# EasyEDA Pro project 04_InterfacePart.epro

# Schematic Schematic4
Create Date: 2024-08-07; Page Name: P1; Project Name: 264母板; Schematic Name: Schematic4; Update Date: 2024-08-07; Company: 嘉立创EDA; Page Size: A3; Version: V1.0
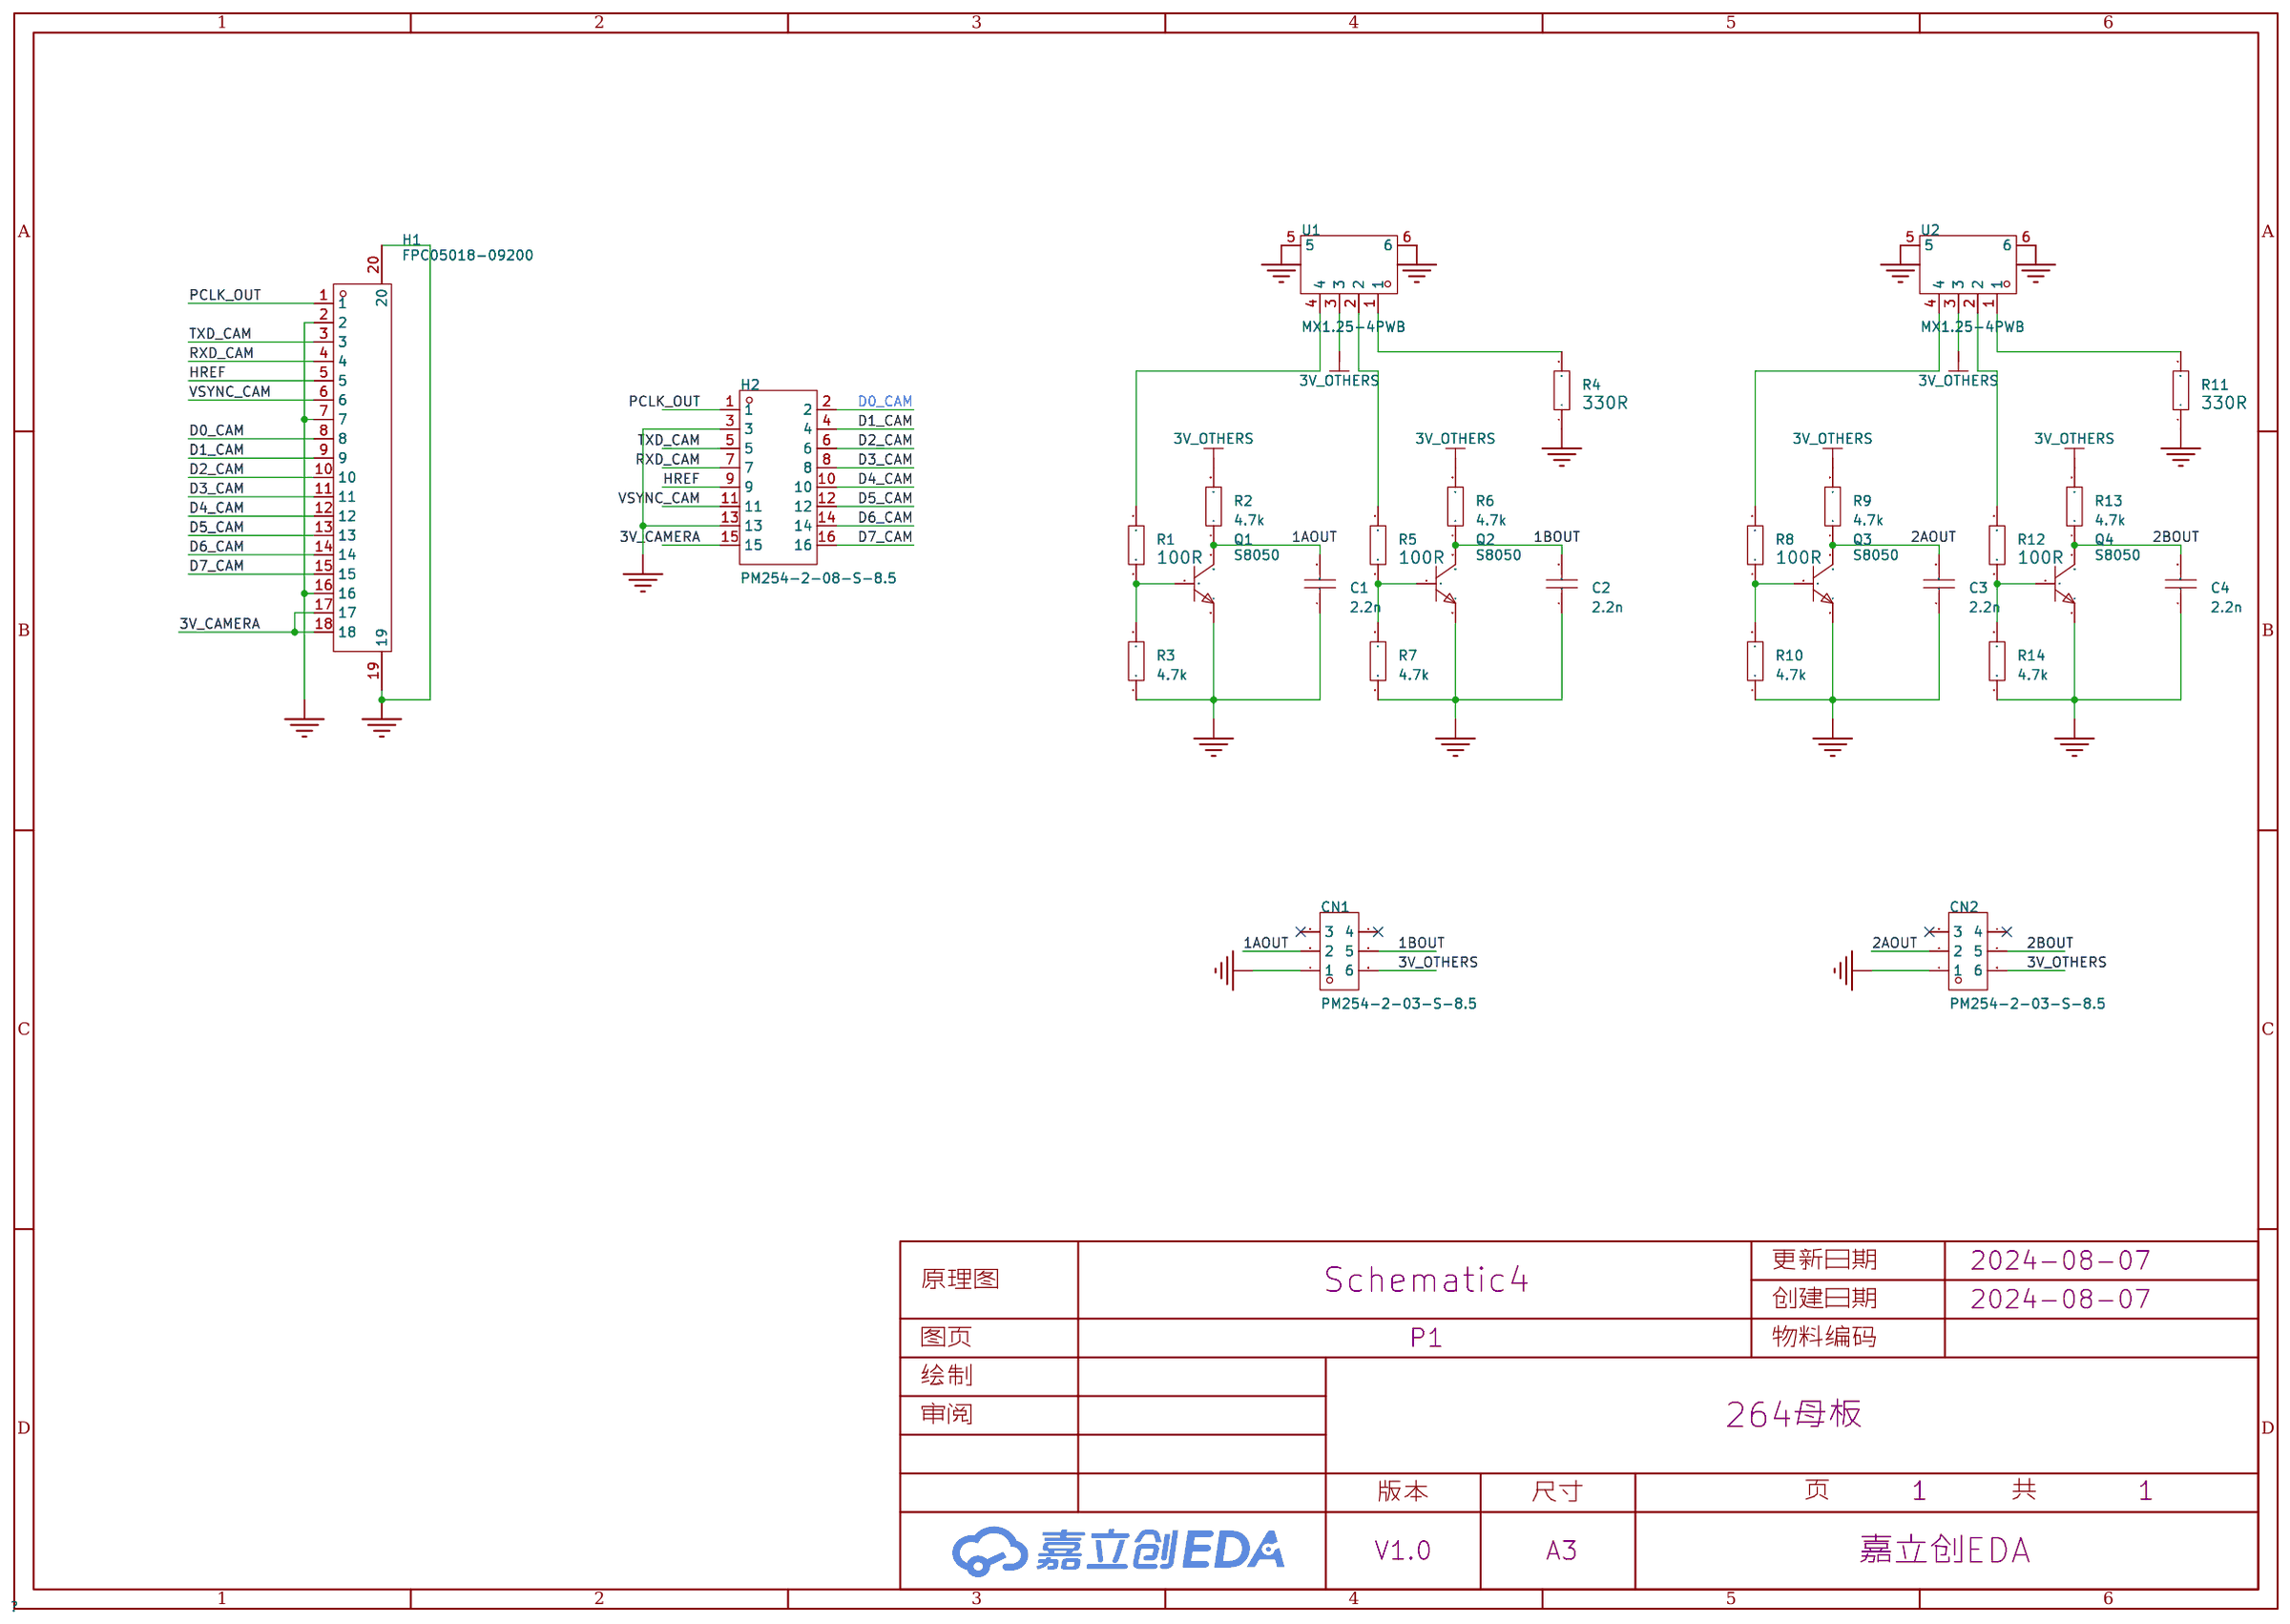
[diagram p0: schematic sheet]

## Parts
C1  2.2n  [C0805]
C2  2.2n  [C0805]
C3  2.2n  [C0805]
C4  2.2n  [C0805]
CN1  PM254-2-03-S-8.5  [HDR-SMD_6P-P2.54-V-F-R2-C3-LS7.0]
CN2  PM254-2-03-S-8.5  [HDR-SMD_6P-P2.54-V-F-R2-C3-LS7.0]
H1  FPC05018-09200  [FPC-SMD_FPC05018-09200]
H2  PM254-2-08-S-8.5  [HDR-SMD_16P-P2.54-V-F-R2-C8-LS7.1]
Q1  S8050  [SOT-23-3_L2.9-W1.6-P1.90-LS2.8-BR]
Q2  S8050  [SOT-23-3_L2.9-W1.6-P1.90-LS2.8-BR]
Q3  S8050  [SOT-23-3_L2.9-W1.6-P1.90-LS2.8-BR]
Q4  S8050  [SOT-23-3_L2.9-W1.6-P1.90-LS2.8-BR]
R1  100R  [R0805]
R2  4.7k  [R0805]
R3  4.7k  [R0805]
R4  330R  [R0805]
R5  100R  [R0805]
R6  4.7k  [R0805]
R7  4.7k  [R0805]
R8  100R  [R0805]
R9  4.7k  [R0805]
R10  4.7k  [R0805]
R11  330R  [R0805]
R12  100R  [R0805]
R13  4.7k  [R0805]
R14  4.7k  [R0805]
U1  MX1.25-4PWB  [CONN-SMD_4P-P1.25_WAFER-MX1.25-4PWB]
U2  MX1.25-4PWB  [CONN-SMD_4P-P1.25_WAFER-MX1.25-4PWB]

## Library data of the parts
C1-C4 = 电容-0805C
CN1 CN2 = PM254-2-03-S-8.5: 插孔结构:2x3P;间距:2.54mm;行距:2.54mm;圆孔/方孔:方孔;安装类型:立贴;排数:双排;总孔位数:6P;额定电流:3A;插孔方向:顶部;塑高:8.5mm;触头材质:铜合金;工作温度范围:-40℃~+105℃;焊接温度(最大值):260℃@5S;; LCSC Part Name: 2x3P 间距:2.54mm 立贴; Supplier Part: C3975148; Manufacturer: HCTL(华灿天禄); Supplier Footprint: SMD,P=2.54mm; Datasheet: https://atta.szlcsc.com/upload/public/pdf/source/20230609/7C6F8D8E301C6BBC8F19D55951C36597.pdf; Supplier: LCSC; Holes Structure: 2x3P; Pitch: 2.54mm; Row Spacing: 2.54mm; Circular Hole / Square Hole: 方孔; Mounting Type: 立贴; Number of Rows: 双排; Number of Holes: 6P; Current Rating (Max): 3A; Holes Direction: 顶部; Insulation Height: 8.5mm; Contact Material: 铜合金; Operating Temperature Range: -40℃~+105℃; Soldering Temperature(Max): 260℃@5S
H1 = FPC05018-09200: 锁定特性:翻盖式;触点类型:下接;触点数量:18P;间距:0.5mm;安装类型:卧贴;工作温度范围:-25℃~+85℃;; LCSC Part Name: 间距:0.5mm P数:18P 翻盖式 下接; Supplier Part: C496146; Manufacturer: ATOM(爱特姆); Supplier Footprint: SMD,P=0.5mm,卧贴; JLCPCB Part Class: 扩展库; Datasheet: https://atta.szlcsc.com/upload/public/pdf/source/20200316/C496142_1ABE0A27956B0C1E9F30CD4659CEC744.pdf; Supplier: LCSC; Locking Feature: 翻盖式; Contact Type: 下接; Number of Contacts: 18P; Pitch: 0.5mm; Mounting Type: 卧贴; FFC, FCB Thickness: 0.3mm; Height Above Board: 2mm; Operating Temperature Range: -25℃~+85℃
H2 = PM254-2-08-S-8.5: 插孔结构:2x8P;间距:2.54mm;行距:2.54mm;圆孔/方孔:方孔;安装类型:立贴;排数:双排;总孔位数:16P;额定电流:3A;插孔方向:顶部;塑高:8.5mm;触头材质:铜合金;工作温度范围:-40℃~+105℃;焊接温度(最大值):260℃@5S;; LCSC Part Name: 2x8P 间距:2.54mm 立贴; Supplier Part: C3975153; Manufacturer: HCTL(华灿天禄); Supplier Footprint: SMD,P=2.54mm; Datasheet: https://atta.szlcsc.com/upload/public/pdf/source/20230609/7C6F8D8E301C6BBC8F19D55951C36597.pdf; Supplier: LCSC; Holes Structure: 2x8P; Pitch: 2.54mm; Row Spacing: 2.54mm; Circular Hole / Square Hole: 方孔; Mounting Type: 立贴; Number of Rows: 双排; Number of Holes: 16P; Current Rating (Max): 3A; Holes Direction: 顶部; Insulation Height: 8.5mm; Contact Material: 铜合金; Operating Temperature Range: -40℃~+105℃; Soldering Temperature(Max): 260℃@5S
Q1-Q4 = S8050_SOT23: Supplier Part: C5249674; Manufacturer: ElecSuper(静芯微）; Supplier Footprint: SOT-23; JLCPCB Part Class: 扩展库; Datasheet: https://atta.szlcsc.com/upload/public/pdf/source/20221109/F3F5EDE41344C501BF02B6CC0D78E6D8.pdf; Supplier: LCSC
R1-R14 = 电阻_0805: 电阻类型:厚膜电阻;阻值:1kΩ;精度:±1%;功率:125mW;温度系数:±100ppm/℃;最大工作电压:150V;工作温度范围:-55℃~+155℃;
U1 U2 = WAFER-MX1.25-4PWB: 插针结构:1x4P;间距:1.25mm;安装方式:卧贴;总PIN数:4P;排数:1;每排PIN数:4;额定电流:1A;工作温度范围:-25℃~+85℃;; LCSC Part Name: 1x4P 间距:1.25mm 卧贴; Supplier Part: C3029361; Manufacturer: XUNPU(讯普); Supplier Footprint: SMD,P=1.25mm,卧贴; JLCPCB Part Class: 扩展库; Datasheet: https://atta.szlcsc.com/upload/public/pdf/source/20220527/5ACBB683E384B6AD06743F272F933620.pdf; Supplier: LCSC; Pins Structure: 1x4P; Pitch: 1.25mm; Mounting Style: 卧贴; Number of Pins: 4P; Number of Rows: 1; Number of PINs Per Row: 4; Current Rating (Max): 1A; Operating Temperature Range: -25℃~+85℃

## Nets
3V_CAMERA: H1.17 H1.18 H2.15
3V_OTHERS: CN1.6 CN2.6 R2.2 R6.2 R9.2 R13.2 U1.3 U2.3
GND: C1.1 C2.1 C3.1 C4.1 CN1.1 CN2.1 H1.2 H1.7 H1.16 H1.19 H1.20 H2.3 H2.13 Q1.2(E) Q2.2(E) Q3.2(E) Q4.2(E) R3.1 R4.1 R7.1 R10.1 R11.1 R14.1 U1.5 U1.6 U2.5 U2.6
1AIN: R1.2 U1.4
1AOUT: C1.2 CN1.2 Q1.3(C) R2.1
1BIN: R5.2 U1.2
1BOUT: C2.2 CN1.5 Q2.3(C) R6.1
2AIN: R8.2 U2.4
2AOUT: C3.2 CN2.2 Q3.3(C) R9.1
2BIN: R12.2 U2.2
2BOUT: C4.2 CN2.5 Q4.3(C) R13.1
D0_CAM: H1.8 H2.2
D1_CAM: H1.9 H2.4
D2_CAM: H1.10 H2.6
D3_CAM: H1.11 H2.8
D4_CAM: H1.12 H2.10
D5_CAM: H1.13 H2.12
D6_CAM: H1.14 H2.14
D7_CAM: H1.15 H2.16
HREF: H1.5 H2.9
PCLK_OUT: H1.1 H2.1
RXD_CAM: H1.4 H2.7
TXD_CAM: H1.3 H2.5
VSYNC_CAM: H1.6 H2.11
$1N470: Q1.1(B) R1.1 R3.2
$1N985: Q2.1(B) R5.1 R7.2
$1N1437: Q3.1(B) R8.1 R10.2
$1N1454: Q4.1(B) R12.1 R14.2
Net-(R4-2): R4.2 U1.1
Net-(R11-2): R11.2 U2.1

Not connected (* = marked no-connect by the designer): CN1 3* 4*; CN2 3* 4*

# Board PCB7
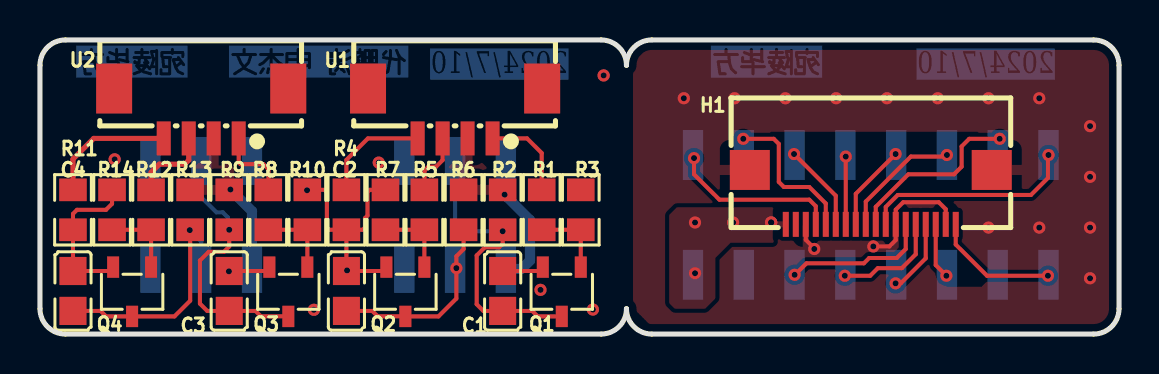
[diagram p1: board, top side]
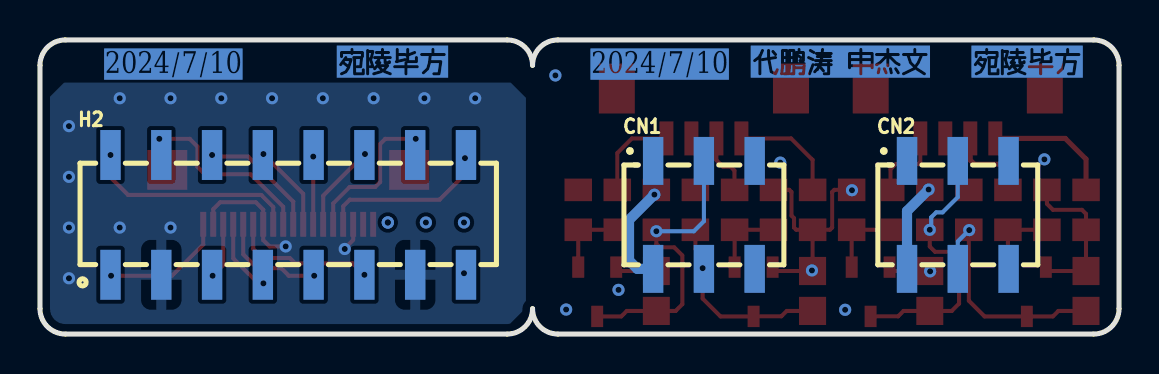
[diagram p2: board, bottom side, seen from below]

Outline 53.97 x 14.73 mm; copper layers: Top Layer, Bottom Layer. Coordinates in mm from the lower left corner of the outline.
Outline path: 0,13.46 0,1.27 arc(0.37,0.37) 1.27,0 28.07,0 arc(28.97,0.37) 29.34,1.27 arc(29.71,0.37) 30.61,0 52.7,0 arc(53.6,0.37) 53.97,1.27 53.97,13.46 arc(53.6,14.36) 52.7,14.73 30.61,14.73 arc(29.71,14.36) 29.34,13.46 arc(28.97,14.36) 28.07,14.73 1.27,14.73 arc(0.37,14.36) 0,13.46
Stack: Top Layer 0.035mm / Dielectric1 1.51mm FR4 er 4.5 / Bottom Layer 0.035mm

## Design rules (mm)
template: 自定义配置
spacing copperThickness1oz (default): track to track 0.102, other pairs 0 to 0.3
spacing copperThickness2oz: track to track 0.203, other pairs 0.152 to 0.3
track width copperThickness1oz (default): min 0.127, default 0.203, max 2.54
track width copperThickness2oz: min 0.203, default 0.254, max 2.54
differential pair differentialPair (default): width min 0.127, default 0.254, max 2.54; gap min 0.152, default 0.152
via viaSize (default): diameter min 0.5, default 0.61, max 10; hole min 0.3, default 0.305, max 6.299
pour e90 uses FULL
pour e95 uses FULL
pour e508 uses FULL
pour e797 uses FULL
pour e816 uses 40mil
pour e28 uses costum
pour e354 uses copperRegion

## Placement (name value [footprint] x y rotation side)
C1  2.2n  [C0805]  23.14 2.16 270 top
C2  2.2n  [C0805]  15.33 2.16 270 top
C3  2.2n  [C0805]  9.47 2.16 270 top
C4  2.2n  [C0805]  1.65 2.16 270 top
CN1  PM254-2-03-S-8.5  [HDR-SMD_6P-P2.54-V-F-R2-C3-LS7.0]  20.76 5.97 180 bottom
CN2  PM254-2-03-S-8.5  [HDR-SMD_6P-P2.54-V-F-R2-C3-LS7.0]  8.06 5.97 180 bottom
H1  FPC05018-09200  [FPC-SMD_FPC05018-09200]  41.56 6.86 180 top
H2  PM254-2-08-S-8.5  [HDR-SMD_16P-P2.54-V-F-R2-C8-LS7.1]  41.56 5.97 180 bottom
Q1  S8050  [SOT-23-3_L2.9-W1.6-P1.90-LS2.8-BR]  26.1 2.12 90 top
Q2  S8050  [SOT-23-3_L2.9-W1.6-P1.90-LS2.8-BR]  18.28 2.12 90 top
Q3  S8050  [SOT-23-3_L2.9-W1.6-P1.90-LS2.8-BR]  12.42 2.12 90 top
Q4  S8050  [SOT-23-3_L2.9-W1.6-P1.90-LS2.8-BR]  4.61 2.12 90 top
R1  100R  [R0805]  25.1 6.22 90 top
R2  4.7k  [R0805]  23.14 6.22 90 top
R3  4.7k  [R0805]  27.05 6.22 270 top
R4  330R  [R0805]  15.33 6.22 90 top
R5  100R  [R0805]  19.23 6.22 90 top
R6  4.7k  [R0805]  21.19 6.22 90 top
R7  4.7k  [R0805]  17.28 6.22 270 top
R8  100R  [R0805]  11.42 6.22 90 top
R9  4.7k  [R0805]  9.47 6.22 90 top
R10  4.7k  [R0805]  13.37 6.22 270 top
R11  330R  [R0805]  1.65 6.22 90 top
R12  100R  [R0805]  5.56 6.22 90 top
R13  4.7k  [R0805]  7.51 6.22 90 top
R14  4.7k  [R0805]  3.6 6.22 270 top
U1  MX1.25-4PWB  [CONN-SMD_4P-P1.25_WAFER-MX1.25-4PWB]  20.76 11.05 180 top
U2  MX1.25-4PWB  [CONN-SMD_4P-P1.25_WAFER-MX1.25-4PWB]  8.06 11.05 180 top

## Footprints (pads in the part's own frame, mm; a bottom-side part is the same pattern mirrored in y, then rotated)
C0805
  rect 1.41x1.35 smd: 1(-1,0) 2(1,0)
CONN-SMD_4P-P1.25_WAFER-MX1.25-4PWB
  rect 0.7x1.7 smd: 1(-1.875,1.25) 2(-0.625,1.25) 3(0.625,1.25) 4(1.875,1.25)
  rect 1.8x2.5 smd: 5(4.355,-1.25) 6(-4.355,-1.25)
FPC-SMD_FPC05018-09200
  rect 0.3x1.25 smd: 1(-4.25,1.363) 2(-3.75,1.363) 3(-3.25,1.363) 4(-2.75,1.363) 5(-2.25,1.363) 6(-1.75,1.363) 7(-1.25,1.363) 8(-0.75,1.363) 9(-0.25,1.363) 10(0.25,1.363) 11(0.75,1.363) 12(1.25,1.363) 13(1.75,1.363) 14(2.25,1.363) 15(2.75,1.363) 16(3.25,1.363) 17(3.75,1.363) 18(4.25,1.363)
  rect 2x2 smd: 19(6.05,-1.363) 20(-6.05,-1.363)
HDR-SMD_6P-P2.54-V-F-R2-C3-LS7.0
  rect 1.02x2.4 smd: 1(-2.54,2.704) 2(0,2.704) 3(2.54,2.704) 4(2.54,-2.704) 5(0,-2.704) 6(-2.54,-2.704)
HDR-SMD_16P-P2.54-V-F-R2-C8-LS7.1
  rect 1.02x2.5 smd: 1(-8.89,-3) 2(-8.89,3) 3(-6.35,-3) 4(-6.35,3) 5(-3.81,-3) 6(-3.81,3) 7(-1.27,-3) 8(-1.27,3) 9(1.27,-3) 10(1.27,3) 11(3.81,-3) 12(3.81,3) 13(6.35,-3) 14(6.35,3) 15(8.89,-3) 16(8.89,3)
R0805
  rect 1.133x1.377 smd: 1(-1,0) 2(1,0)
SOT-23-3_L2.9-W1.6-P1.90-LS2.8-BR
  rect 1.07x0.6 smd: 1(1.235,-0.95) 2(1.235,0.95) 3(-1.235,0)

## Nets
3V_CAMERA: H1.17 H1.18 H2.15
3V_OTHERS: CN1.6 CN2.6 R2.2 R6.2 R9.2 R13.2 U1.2 U2.2
GND: C1.1 C2.1 C3.1 C4.1 CN1.1 CN2.1 H1.2 H1.7 H1.16 H1.19 H1.20 H2.3 H2.13 Q1.2 Q2.2 Q3.2 Q4.2 R3.1 R4.1 R7.1 R10.1 R11.1 R14.1 U1.5 U1.6 U2.5 U2.6
1AIN: R1.2 U1.1
1AOUT: C1.2 CN1.2 Q1.3 R2.1
1BIN: R5.2 U1.3
1BOUT: C2.2 CN1.5 Q2.3 R6.1
2AIN: R8.2 U2.1
2AOUT: C3.2 CN2.2 Q3.3 R9.1
2BIN: R12.2 U2.3
2BOUT: C4.2 CN2.5 Q4.3 R13.1
D0_CAM: H1.8 H2.2
D1_CAM: H1.9 H2.4
D2_CAM: H1.10 H2.6
D3_CAM: H1.11 H2.8
D4_CAM: H1.12 H2.10
D5_CAM: H1.13 H2.12
D6_CAM: H1.14 H2.14
D7_CAM: H1.15 H2.16
HREF: H1.5 H2.9
PCLK_OUT: H1.1 H2.1
RXD_CAM: H1.4 H2.7
TXD_CAM: H1.3 H2.5
VSYNC_CAM: H1.6 H2.11
$1N470: Q1.1 R1.1 R3.2
$1N768: R4.2 U1.4
$1N985: Q2.1 R5.1 R7.2
$1N1437: Q3.1 R8.1 R10.2
$1N1447: R11.2 U2.4
$1N1454: Q4.1 R12.1 R14.2

Pads without a net: CN1 3 4; CN2 3 4

## Via types
v1: diameter 0.61, hole 0.305, Top Layer to Bottom Layer, 49 vias

## Routing (per net, layer and track width the routed paths; a pad name or vN(x,y) marks a point on that pad's centre or on a via; arc(x,y) is an arc through that point)
3V_CAMERA:
  vias: v1(32.77,5.59) v1(32.77,3.05) v1(34.67,5.59) v1(36.58,5.59) v1(36.58,5.59)
3V_OTHERS: length 9.6
  Bottom Layer w0.508: v1(9.53,7.24) 10.6,6.16 CN2.6 ; v1(23.24,6.98) 24.51,5.71 24.51,3.68 24.09,3.27 CN1.6
GND: length 31.4
  Top Layer w0.203: C1.1 24.96,3.16 Q1.2 ; Q4.2 3.46,3.16 C4.1 R11.1 1.65,6.02 1.85,6.22 3.3,6.22 3.6,6.53 R14.1 ; R10.1 14.24,7.22 14.35,7.11 14.35,5.33 14.46,5.22 R4.1 ; C3.1 11.28,3.16 11.47,3.35 ; R4.1 16.14,5.22 16.26,5.33 16.26,5.8 16.38,5.93 16.38,7.11 16.49,7.22 R7.1 ; R4.1 C2.1 17.13,3.16 Q2.2 ; v1(41.68,4.39) 42.49,4.39 42.81,4.71 H1.7 42.81,6.23 43.18,6.6 44.96,6.6 45.31,6.26 H1.2 ; H1.16 38.31,4.72 38.73,4.3 v1(38.73,4.26)
  vias: v1(3.73,8.75) v1(9.45,3.14) v1(13.36,7.2) v1(13.7,1.22) v1(15.36,3.19) v1(16.95,8.59) v1(25.04,2.21) v1(27.66,1.23) v1(28.19,12.95) v1(32.21,11.81) v1(34.75,11.81) v1(37.29,11.81) v1(39.83,11.81) v1(42.37,11.81) v1(44.91,11.81) v1(47.45,11.81) v1(47.45,5.33) v1(49.99,11.81) v1(49.99,5.33) v1(52.53,10.41) v1(52.53,7.87) v1(52.53,5.33) v1(52.53,2.79)
1AIN: length 4.6
  Top Layer w0.203: R1.2 25.1,9.07 24.36,9.8 U1.1
1AOUT: length 14.8
  Top Layer w0.203: Q1.3 24.9,0.88 24.62,1.16 C1.2 22.18,1.16 21.84,1.49 21.84,3.94 22.25,4.35 22.97,4.35 23.14,4.52 R2.1
  Bottom Layer w0.203: v1(23.14,5.15) 21.27,5.15 20.76,5.65 20.76,8.67
1BIN: length 3.2
  Top Layer w0.203: 19.24,7.22 19.24,8.19 19.43,8.38 19.81,8.38 20.14,8.71 U1.3
1BOUT: length 9.6
  Top Layer w0.203: C2.2 16.62,1.16 16.89,0.89 18.27,0.89 Q2.3 19.93,0.88 20.83,1.78 v1(20.83,3.3) 20.83,3.9 21.19,4.26 R6.1
2AIN: length 3.9
  Top Layer w0.203: R8.2 11.43,7.23 11.43,8.25 11.18,8.51 10.03,8.51 9.94,8.6 U2.1
2AOUT: length 13.6
  Top Layer w0.203: v1(9.47,5.22) 9.47,4.39 9.2,4.12 8.44,4.12 8,3.68 8,1.52 8.37,1.16 C3.2 10.78,1.16 11.05,0.89 12.42,0.89 Q3.3
  Bottom Layer w0.203: 9.4,5.21 9.4,5.84 9.14,6.1 8.83,6.1 8.06,6.86 8.06,8.67
2BIN: length 4.1
  Top Layer w0.254: 7.44,9.8 7.44,8.71 7.24,8.51 5.97,8.51 5.56,8.1 R12.2
2BOUT: length 12
  Top Layer w0.203: C4.2 3.03,1.16 3.31,0.88 Q4.3 6.73,0.88 7.51,1.67 R13.1
  Bottom Layer w0.203: v1(7.49,5.21) 8.06,4.64 CN2.5
D0_CAM: length 10.7
  Top Layer w0.203: 50.42,8.89 50.42,7.82 49.57,6.97 42.91,6.97 42.31,6.37 H1.8
  vias: v1(50.45,8.97)
D1_CAM: length 9.1
  Top Layer w0.203: H1.9 41.81,6.37 43.43,8 45.72,8 46.1,8.38 46.1,9.4 46.48,9.78 v1(48.01,9.78)
D2_CAM: length 6.1
  Top Layer w0.203: H1.10 41.31,6.64 43.56,8.89 45.34,8.89
  vias: v1(45.37,8.97)
D3_CAM: length 4.3
  Top Layer w0.203: v1(42.8,9.02) 40.81,7.02 H1.11
D4_CAM: length 3.4
  Top Layer w0.203: H1.12 v1(40.31,8.89)
D5_CAM: length 4.4
  Top Layer w0.203: v1(37.72,9.02) 39.81,6.93 H1.13
D6_CAM: length 7.6
  Top Layer w0.203: v1(35.18,9.78) 36.7,9.78 36.96,9.52 36.96,7.62 37.21,7.37 38.48,7.37 39.31,6.54 H1.14
D7_CAM: length 8.5
  Top Layer w0.203: v1(32.72,8.81) 32.72,8 33.99,6.73 38.48,6.73 38.81,6.41 H1.15
HREF: length 5.5
  Top Layer w0.203: H1.5 43.81,4 43.11,3.3 41.91,3.3 41.53,2.92 v1(40.26,2.92)
PCLK_OUT: length 6.3
  Top Layer w0.203: H1.1 45.81,4.48 47.37,2.92 v1(50.42,2.92)
RXD_CAM: length 3.7
  Top Layer w0.203: v1(42.8,2.54) 43.05,2.54 44.31,3.79 H1.4
TXD_CAM: length 2.8
  Top Layer w0.203: H1.3 44.81,3.45 v1(45.34,2.92)
VSYNC_CAM: length 7.4
  Top Layer w0.203: H1.6 43.31,4.26 42.86,3.81 41.48,3.81 41.21,3.54 38.34,3.54 37.72,2.92
  vias: v1(37.75,2.97)
$1N470: length 3.8
  Top Layer w0.203: R1.1 R3.2 Q1.1
$1N768: length 5.5
  Top Layer w0.203: U1.4 16.4,9.8 15.33,8.72 R4.2
$1N985: length 3.8
  Top Layer w0.203: Q2.1 R5.1 R7.2
$1N1437: length 3.8
  Top Layer w0.203: Q3.1 R10.2 R8.1
$1N1447: length 6.5
  Top Layer w0.254: U2.4 2.69,9.8 1.65,8.76 R11.2
$1N1454: length 3.8
  Top Layer w0.203: R14.2 R12.1 5.56,3.41 5.5,3.35

## Copper pours and planes (outline as drawn; the poured copper is in the pictures)
3V_CAMERA on Top Layer: 31.75,1.27 33.27,1.27 33.78,1.78 33.78,3.81 34.54,4.57 37.72,4.57 37.97,4.83 37.97,6.22 37.85,6.35 31.85,6.35 31.47,5.97 31.47,1.55
3V_OTHERS on Top Layer: 8.38,9.02 7.37,8 6.97,8 6.6,7.63 6.6,6.49 6.86,6.22 10.12,6.22 10.12,6.23 10.38,6.49 10.38,7.9 10.29,8 10.03,8 9.01,9.02
3V_OTHERS on Top Layer: 21.64,9.06 22.53,8.17 23.69,8.17 24.06,7.8 24.06,6.66 23.8,6.39 20.53,6.39 20.53,6.4 20.27,6.66 20.27,8.2 21.13,9.06
GND on Top Layer: -29.21,23.18 -28.32,24.07 -1.72,24.07 -0.58,22.93 -0.58,10.99 -1.72,9.85 -28.15,9.85 -29.21,10.91
GND on Top Layer: 29.67,13.59 30.56,14.48 52.83,14.48 53.72,13.59 53.72,1.14 52.83,0.25 30.72,0.25 29.67,1.31
GND on Bottom Layer: 29.67,11.83 30.43,12.6 52.77,12.6 53.72,11.64 53.72,1.14 52.83,0.25 30.72,0.25 29.67,1.31
GND on Bottom Layer: -34.01,11.79 -33.21,12.58 -6.02,12.58 -5.38,11.94 -5.38,1.51 -6.52,0.37 -32.95,0.37 -34.01,1.43

## Text on the board
Bottom Layer: 宛陵毕方 | 代鹏涛 申杰文 | 2024/7/10
